# Altium schematic sheet Sensado.SchDoc
size A1; Organization: Protel International P/L; Address1: L3, 12a Rodborough Rd; Address2: Frenchs Forest; Address3: NSW; Address4: Australia 2086
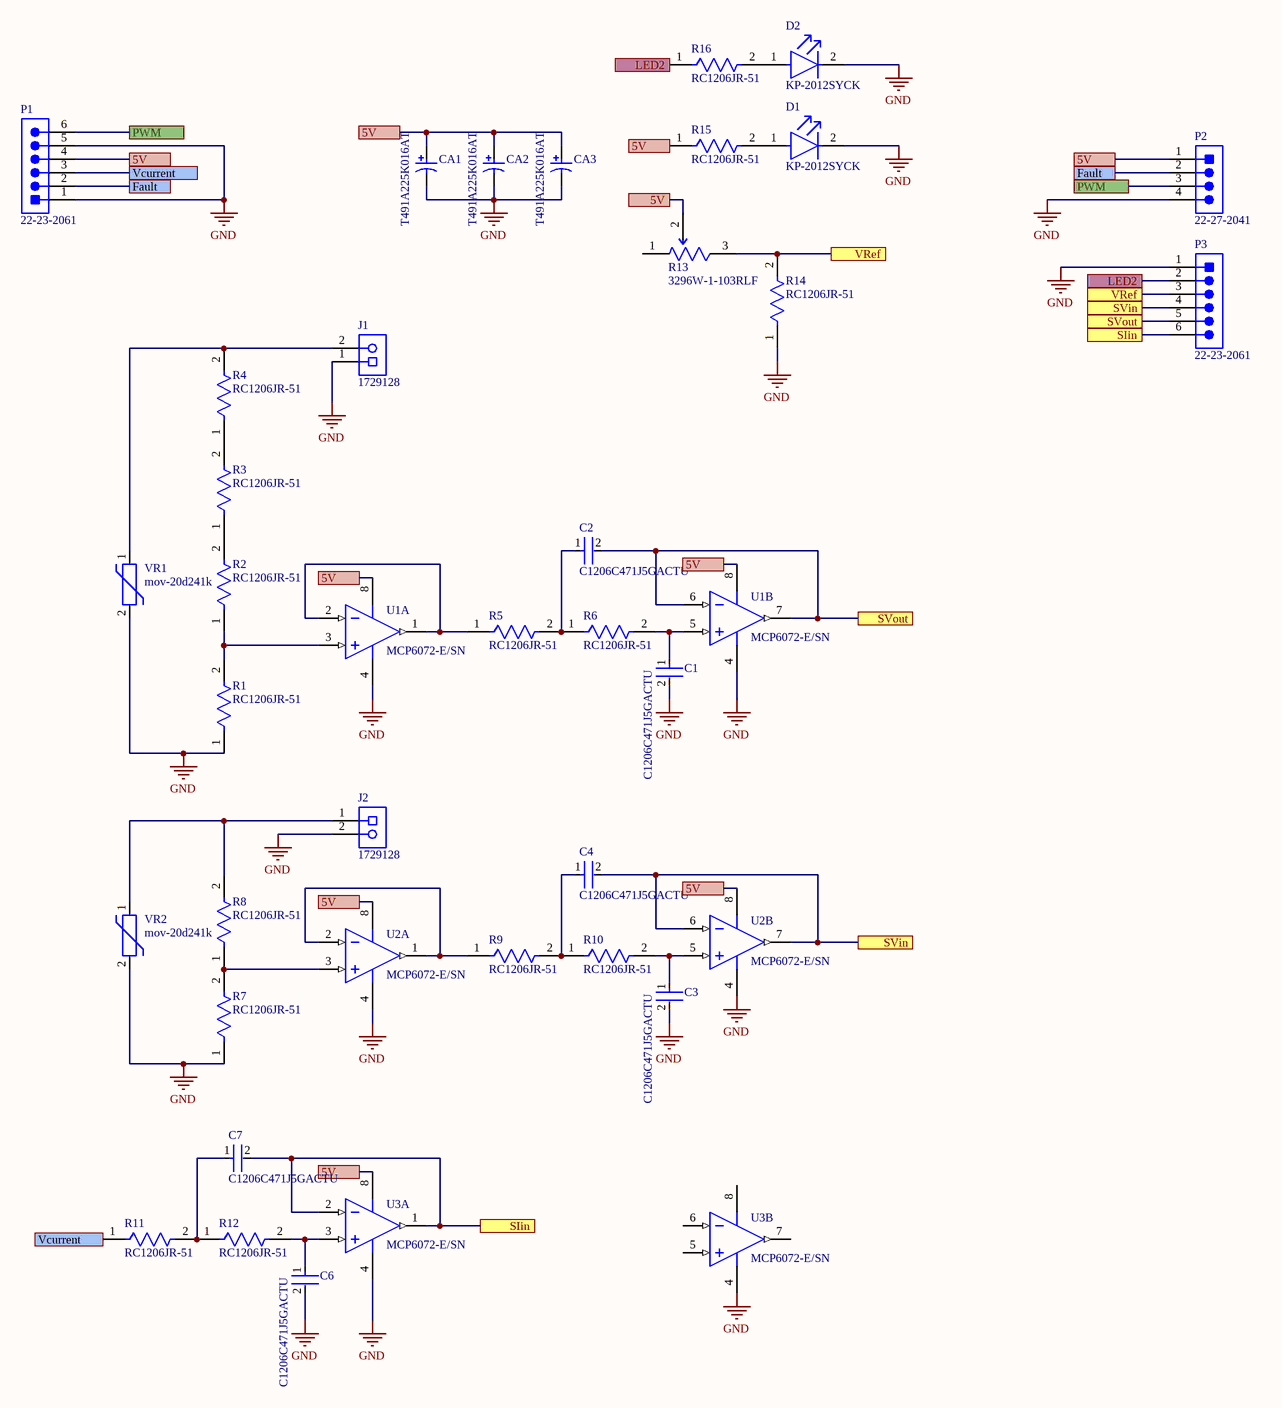
[diagram p0: Sensado.SchDoc]

## Parts
C1  C1206C471J5GACTU  [FP-C1206C-EB-IPC_B]
C2  C1206C471J5GACTU  [FP-C1206C-EB-IPC_B]
C3  C1206C471J5GACTU  [FP-C1206C-EB-IPC_B]
C4  C1206C471J5GACTU  [FP-C1206C-EB-IPC_B]
C6  C1206C471J5GACTU  [FP-C1206C-EB-IPC_B]
C7  C1206C471J5GACTU  [FP-C1206C-EB-IPC_B]
CA1  T491A225K016AT  [KEMT-T491-A_N]
CA2  T491A225K016AT  [KEMT-T491-A_N]
CA3  T491A225K016AT  [KEMT-T491-A_N]
D1  KP-2012SYCK  [FP-KP-2012SYCK-MFG]
D2  KP-2012SYCK  [FP-KP-2012SYCK-MFG]
J1  1729128  [PHOE-1729128-2_V]
J2  1729128  [PHOE-1729128-2_V]
P1  22-23-2061  [MOLX-22-23-2061_V]
P2  22-27-2041  [MOLX-22-27-2041_V]
P3  22-23-2061  [MOLX-22-23-2061_V]
R1  RC1206JR-51  [FP-RC1206-IPC_B]
R2  RC1206JR-51  [FP-RC1206-IPC_B]
R3  RC1206JR-51  [FP-RC1206-IPC_B]
R4  RC1206JR-51  [FP-RC1206-IPC_B]
R5  RC1206JR-51  [FP-RC1206-IPC_B]
R6  RC1206JR-51  [FP-RC1206-IPC_B]
R7  RC1206JR-51  [FP-RC1206-IPC_B]
R8  RC1206JR-51  [FP-RC1206-IPC_B]
R9  RC1206JR-51  [FP-RC1206-IPC_B]
R10  RC1206JR-51  [FP-RC1206-IPC_B]
R11  RC1206JR-51  [FP-RC1206-IPC_B]
R12  RC1206JR-51  [FP-RC1206-IPC_B]
R13  3296W-1-103RLF  [FP-3296W-MFG]
R14  RC1206JR-51  [FP-RC1206-IPC_B]
R15  RC1206JR-51  [FP-RC1206-IPC_B]
R16  RC1206JR-51  [FP-RC1206-IPC_B]
U1  MCP6072-E/SN  [SOIC-SN8_L]  (parts A,B of 2)
U2  MCP6072-E/SN  [SOIC-SN8_L]  (parts A,B of 2)
U3  MCP6072-E/SN  [SOIC-SN8_L]  (parts A,B of 2)
VR1  mov-20d241k  [Axial 10MM]
VR2  mov-20d241k  [Axial 10MM]

## Ports
5V, Fault, LED2, PWM, SIin, SVin, SVout, Vcurrent, VRef

## Nets
GND: C1.2 C3.2 C6.2 CA1.2 CA2.2 CA3.2 D1.2(C) D2.2(C) J1.1 J2.2 P1.1 P1.5 P2.4 P3.1 R1.1 R7.1 R14.1 U1.4(VSS) U2.4(VSS) U3.4(VSS) VR1.2 VR2.2
5V: CA1.1 CA2.1 CA3.1 P1.4 P2.1 R13.2(WIPER) R15.1 U1.8(VDD) U2.8(VDD) U3.8(VDD) ; port 5V
Fault: P1.2 P2.2 ; port Fault
LED2: P3.2 R16.1 ; port LED2
PWM: P1.6 P2.3 ; port PWM
SIin: C7.2 P3.6 U3.1(VOUTA) U3.2(VINA-) ; port SIin
SVin: C4.2 P3.4 U2.6(VINB-) U2.7(VOUTB) ; port SVin
SVout: C2.2 P3.5 U1.6(VINB-) U1.7(VOUTB) ; port SVout
Vcurrent: P1.3 R11.1 ; port Vcurrent
VRef: P3.3 R13.3(CW) R14.2 ; port VRef
NetC1_1: C1.1 R6.2 U1.5(VINB+)
NetC2_1: C2.1 R5.2 R6.1
NetC3_1: C3.1 R10.2 U2.5(VINB+)
NetC4_1: C4.1 R9.2 R10.1
NetC6_1: C6.1 R12.2 U3.3(VINA+)
NetC7_1: C7.1 R11.2 R12.1
NetD1_1: D1.1(A) R15.2
NetD2_1: D2.1(A) R16.2
NetJ1_2: J1.2 R4.2 VR1.1
NetJ2_1: J2.1 R8.2 VR2.1
NetR1_2: R1.2 R2.1 U1.3(VINA+)
NetR2_2: R2.2 R3.1
NetR3_2: R3.2 R4.1
NetR5_1: R5.1 U1.1(VOUTA) U1.2(VINA-)
NetR7_2: R7.2 R8.1 U2.3(VINA+)
NetR9_1: R9.1 U2.1(VOUTA) U2.2(VINA-)

Not connected (* = marked no-connect by the designer): R13 1(CCW); U3 5(VINB+) 6(VINB-) 7(VOUTB)

## Notes on the sheet
- Title
- Size:
- Date:
- File:
- A1
- Number:
- Time:
- Revision:
- Sheet
- of

## Library data of the parts
C1-C4 C6 C7 = CMP-03020-008367-1: 1206 C 470pF Ceramic Multilayer Capacitor; 50 V; +125degC; C0G Dielectric; +/-5%; Manufacturer: KEMET; Tolerance: 0.05; Temperature Coefficient: 15%; Voltage Rating: 50 V; Automotive Grade: Grade 0; Manufacturer Part Number: C1206C471J5GACTU; Value: 470 pF; Automotive: Yes; Temperature Range High: +150°C; ComponentLink2URL: https://content.kemet.com/datasheets/KEM_C1007_X8R_ULTRA_150C_SMD.pdf; Octopart: https://octopart.com/c1206c471j5gactu-kemet-123947; Package: C1206C-EB; Capacitance: 470 pF; Temperature Range Low: -55°C; Material: Ceramic; Device Class L1: Passive Components; Device Class L3: Ceramic Capacitors; Ipc Land Pattern Name: CAPC320160X78; Height: 0.88mm; Category: Cap; Lead Free: Yes; ComponentLink2Description: Datasheet; Temperature: -55°C to +150°C; Mouser Description: 1206 C 470pF Ceramic Multilayer Capacitor; 50 V; +125degC; C0G Dielectric; +/-5%; Device Class L2: Capacitors; RoHS: TRUE; Digikey Description: 1206 C 470pF Ceramic Multilayer Capacitor; 50 V; +125degC; C0G Dielectric; +/-5%; Temperature Characteristic: C0G
CA1-CA3 = CMP-2000-07187-1: Tantalum Capacitor, 2.2 uF, +/- 10%, 16 V, -55 to 125 degC, 2-Pin SMD, RoHS, Tape and Reel; Manufacturer: Kemet; Capacitance: 2200000pF; Product Depth (mm): 1.6mm; DCL: 0.4uA; Wire Form: NotRequired; Case Style: Molded; ESR: 6ohm; Polarity: Polar; Product Length (mm): 3.2mm; Voltage: 16VDC; Lead Spacing (nom): NotRequiredmm; DF: 6%; Rad Hardened: No; Operating Temp Range: -55Cto125C; Datasheet Version: 10/2016; Packaging: TapeandReel; Mounting Style: SurfaceMount; Manufacturer URL: http://www.kemet.com/; Seal: NotRequired; Product Height (mm): 1.6mm; Construction: SMTChip; Length W/Weld: NotRequiredmm; Package Reference: T491-A; Package Description: 2-Pin Surface Mount Device, Body 3.2 x 1.6 mm; Tolerance (+ or -): 10%; Length W/Weld (max): NotRequiredmm; Insulation: NotRequired; Mounting Technology: SurfaceMount; Package / Case: 3216-18; Seated Plane Height: NotRequiredmm; Case Code: A; Datasheet URL: http://capacitoredge.kemet.com/capedge2/DataSheet/Datasheet-T491A225K016AT.pdf?pn=T491A225K016AT; Product Diameter (mm): NotRequiredmm; Failure Rate: NotRequired
D1 D2 = CMP-44529-000002-1: 2.0x1.25mm SMD CHIP LED LAMP; Manufacturer: KINGBRIGHT; Forward Current: 20mA; Reverse Voltage: 5V; Power Dissipation: 75mW; Luminous Intensity: 150mcd; Peak Emmision Wavelength: 590nm; Forward Voltage: 2V; Led Orientation: Top View; Viewing Angle: 120°; Colour: Yellow; Category: Diode; Temperature: -40°C to +85°C; Temperature Range High: +85°C; Device Class L3: unset; Lead Free: Yes; Device Class L1: Optoelectronics; ComponentLink2Description: Datasheet; Octopart: https://octopart.com/kp-2012syck-kingbright-5387420; ComponentLink2URL: http://www.farnell.com/datasheets/2045820.pdf; Package: 0; RoHS: TRUE; Automotive: No; Manufacturer Part Number: KP-2012SYCK; Wavelength: 590nm; Height: 1.1mm; Temperature Range Low: -40°C; Device Class L2: LEDs
J1 J2 = CMP-2000-05815-1: PCB Terminal Block, 13.5 A, 400 V, 2-Pin THD, RoHS, Bulk; Manufacturer: Phoenix Contact; Package Version: 03/2015; No. of Rows: 1; Pitch: 5.08mm; No. of Positions: 2; Voltage Rating: 400V; Current Rating: 13500mA; Manufacturer URL: http://www.phoenixcontact.com/; Datasheet URL: https://datasheet.ciiva.com/16046/1729128-16046181.pdf; RoHS: TRUE; Package URL: https://www.phoenixcontact.com/online/portal/pi/pxc/product_detail_page/!ut/p/b1/3VdJjqNKFDxLH8AFycySyWY2ozFsEPOMMQaDOX1XedGL_1Vdm5YXJleknhSKeBkvI6EA8ncAo3AYoDhBQGco6KN7VURTdemj9us_IEKEZo_YHiPAEWEFmDGOHMORkqKYCORBZxgL7ZoaZYcbFFUZ3fqxSY6GOuxydWUuHqz1ynmMFygu583Bob0Ewr6Sd_l-5m-kAueHiB0jpRwZwe58wwtkpxtMYd_LmGcDRU02dRNEyWt6Y2ti5pSyJ_reIkzIulrqApdnbT11V5jnCKbYNCvhEM1MCpPByat_X379-iThf08CI5GfOPqfBeS3BRoBOdD55AKVv0iLwCMq-2BrzXWSGRH7pUGD9uwXQjiph3xL0DKQwdGa0JImiIOmBNOestqgwTHSSs2oOep-78apyXQBvNi8ZLaFjvjWvcaUEBu0MC6Wbe-d6mB0FAebo2lUWinqYaZs5DAYzV0RP9yitUjnGJ0iI9xhZkT42OCQNUJJhkgWINNQLP2JFP6OpMg3JCVg70jqHT0lvKOnhHf0lPuOnnLf0VPuWx6_dxwUIvwk5WMkT0kLL1mh61l2yZVSzG3pYV_bqo-mj6uMKwKwdnnW8Jh5RTOJzMOA5c-eJDaZQw4mTMPH02PvS_ZAqNVjVTo2WyYLkwH_KU1mmmG5kjRhDqPXLwwVHvVOjCM60-fpXvTDfMGW1PVFVS1r4e4yVDk4ZdNbkUHvqPqQSeian4UD39fNKmachqdJ1NJbyk8rXT9mXTvPk3oE5meulKGgiruPJek-4I9hTT6G8ZLOyRSm2RRVbThERQad5OS28hdt4YW4vG0stgYYzsWsK4_7y6DZMjJSCqri1kyiZR5vD7pwIrNR7QwPHTcLTI5qT7eRlpHrdGiupYlqQDJ7zy_CND8fWWBoLRXxk1RVcXiBQwbTD4Xi7KL-FuO94t9xaqweXzH; PartNumber: 1729128; Package Description: 2-Pin Through Hole Device, Body 8.1 x 10.16 mm, Pitch 5.08 mm; Datasheet Version: 12/2013; Mounting Technology: ThroughHole; Orientation: Horizontal; Package Reference: 1729128-2; Packing: Bulk
P1 P3 = CMP-2000-05536-1: Male Header, Pitch 2.54 mm, 1 x 6 Position, Height 10.67 mm, Tail Length 3.56 mm, 0 to 70 degC, RoHS, Bulk; Manufacturer: Molex; Pitch: 2.54mm; Mounting Angle: Vertical; Current Rating: 4A; Number of Positions / Contacts: 6; Voltage Rating: 250V; Packaging: Bulk; Package Description: Male Header, Pitch 2.54 mm, 1 x 6 Position, Height 10.67 mm, Tail Length 3.56 mm; Number of Rows: 1; Type: PinStrip; Contact Material: Brass; Product Category: .100K.K.Connectors; Factory Pack Quantity: 1000; Mounting Style: ThroughHole; RoHS: Details; Contact Plating: Tin; Housing Material: Nylon; Mounting Technology: ThroughHole; Termination Style: ThroughHole; Tradename: KK; Number of Positions: 6; Brand: Molex; Product Type: Headers; Series: 6373; Datasheet URL: https://datasheet.ciiva.com/19460/232303-19460895.pdf; Package Reference: 22-23-2061; Datasheet Version: Rev. P, 09/2001; Manufacturer URL: http://www.molex.com/
P2 = CMP-2000-05243-1: Male Header, Pitch 2.54 mm, 1 x 4 Position, Height 11.7 mm, Tail Length 3.56 mm, RoHS, Bulk; Manufacturer: Molex; Voltage rating: 250V; Current rating: 4A; Datasheet Version: Rev. F, 06/2009; Operating temperature: 0degCto+75degC; Contact material: Tinplatedbrass; Manufacturer URL: http://www.molex.com/; Housing material: Nylon(UL94V-0); Datasheet URL: http://www.molex.com/pdm_docs/sd/022272041_sd.pdf
R1-R12 R14-R16 = CMP-03412-007570-1: RES SMD 51 OHM  1/4W 1206; Manufacturer Part Number: RC1206JR-070RL; Manufacturer: YAGEO; Voltage Rating: 200V; Temperature Coefficient: 300ppm/°C; Power Rating: 0.25W; Value: 0Ω; Tolerance: 5%; Temperature Range Low: -55°C; Category: Res; Automotive: No; Ipc Land Pattern Name: RESC310160X55; Device Class L1: Passive Components; Temperature: -55°C to +155°C; ComponentLink2URL: https://www.yageo.com/upload/media/product/productsearch/datasheet/rchip/PYu-RC_Group_51_RoHS_L_10.pdf; Lead Free: Yes; Height: 0.65mm; Footprint Url: https://www.yageo.com/upload/website/yageo_PYu-R_Mount_10_19050818_343.pdf; Package: RC1206; Digikey Description: RES SMD 0 OHM JUMPER 1/4W 1206; Temperature Range High: +155°C; Device Class L3: Chip SMD Resistors; Device Class L2: Resistors; Octopart: https://octopart.com/rc1206jr-070rl-yageo-40025601; Resistance: 0Ω; Series: RC; ComponentLink2Description: Datasheet; Composition: Thick Film; RoHS: TRUE; Mouser Description: Resistor: thick film; SMD; 1206; 0O; 0.25W; ±5%; -55÷155°C
R13 = CMP-07234-000024-1: TRIMMER 10K OHM 0.5W PC PIN TOP; Resistance: 10kR; Temperature Coefficient: 100ppm/°C; Power Rating: 500mW; Tolerance: 10%; Number of Turns: 25; Width: 0.19inch; Termination: Pin; Radiation Hardening: No; Contact Plating: Tin; Composition: Cermet; Length: 9.53mm; Height: 0.395inch; Depth: 4.83mm; REACH SVHC: No SVHC; Weight: 0.03oz; Min Operating Temperature: -55°C; Military Standard: Not; Max Operating Temperature: 125°C; Packaging: Tape and Reel; Package Quantity: 1; Taper: Linear; Max Power Dissipation: 500mW; Mount: Through Hole
U1-U3 = CMP-0187-00342-2: 110 Î¼A, High Precision Dual Op Amp, 8-Pin SOIC, Extended Temperature; PackageVersion: revBB, Aug-2009; PackageReference: SOIC-SN8; ComponentLink3Description: Package Specification; RevisionNote: URLs added. DatasheetVersion updated.; Code_IPC: SOIC127P600-8; ComponentLink1URL: http://www.microchip.com/; ComponentLink2URL: http://ww1.microchip.com/downloads/en/DeviceDoc/22142_B_MCP6071.pdf; DatasheetVersion: revB, Dec-2010; ComponentLink2Description: Datasheet; ComponentLink3URL: http://www.microchip.com/stellent/groups/techpub_sg/documents/packagingspec/en012702.pdf; Code_JEDEC: MS-012; ComponentLink1Description: Manufacturer URL; PackageDescription: 8-Lead Plastic Small Outline (SN) - Narrow, 3.90mm Body [SOIC]
VR1 VR2 = mov-20d241k: Varistor de oxido de metal. / Voltaje AC (RMS): 150V. / Voltaje DC: 200V.